# EAGLE design board_lt3086 (EAGLE 6.5.0)
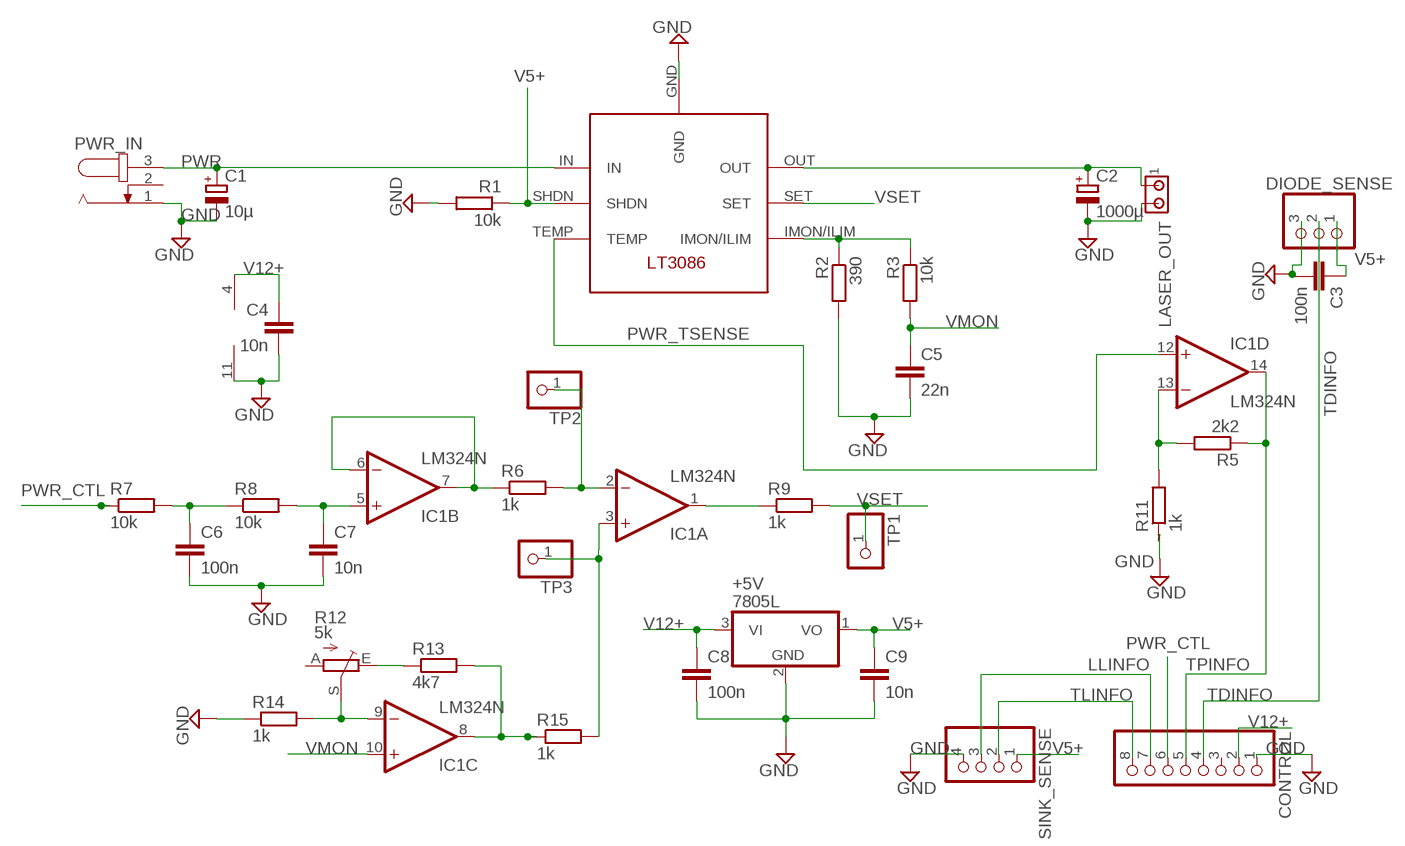
[diagram p0: schematic, sheet 1]

## Parts
+5V  7805L  [TO92]
C1  10µ  CPOL-EUE2.5-7  [E2,5-7]
C2  1000µ  CPOL-EUE3.5-10  [E3,5-10]
C3  100n  C-EU050-035X075  [C050-035X075]
C4  10n  C-EU050-024X044  [C050-024X044]
C5  22n  C-EU050-024X044  [C050-024X044]
C6  100n  C-EU050-035X075  [C050-035X075]
C7  10n  C-EU050-024X044  [C050-024X044]
C8  100n  C-EU050-035X075  [C050-035X075]
C9  10n  C-EU050-024X044  [C050-024X044]
CONTROL  PINHD-1X8  [1X08]
DIODE_SENSE  PINHD-1X3  [1X03]
IC1  LM324N  [DIL14]
LASER_OUT  350428-1  [350428-1]
PWR_CTRL  LT3086  [LT3086-T7]
PWR_IN  JACK-PLUG0  [SPC4077]
R1  10k  R-EU_0207/10  [0207/10]
R2  390  R-EU_0207/10  [0207/10]
R3  10k  R-EU_0207/10  [0207/10]
R5  2k2  R-EU_0207/10  [0207/10]
R6  1k  R-EU_0207/10  [0207/10]
R7  10k  R-EU_0207/10  [0207/10]
R8  10k  R-EU_0207/10  [0207/10]
R9  1k  R-EU_0207/10  [0207/10]
R11  1k  R-EU_0207/10  [0207/10]
R12  5k  TRIM_EU-CA9V  [CA9V]
R13  4k7  R-EU_0207/10  [0207/10]
R14  1k  R-EU_0207/10  [0207/10]
R15  1k  R-EU_0207/10  [0207/10]
SINK_SENSE  PINHD-1X4  [1X04]
TP1  PINHD-1X1  [1X01]
TP2  PINHD-1X1  [1X01]
TP3  PINHD-1X1  [1X01]

## Nets
GND: +5V.2(GND) C1.- C2.- C3.2 C4.2 C5.2 C6.2 C7.2 C8.2 C9.2 CONTROL.1 DIODE_SENSE.3 IC1.11(P:V-) LASER_OUT.2 PWR_CTRL.GND PWR_IN.1 R1.2 R2.2 R11.1 R14.1 SINK_SENSE.4
LLINFO: CONTROL.7 SINK_SENSE.3
N$1: IC1.6(B:-IN) IC1.7(B:OUT) R6.1
N$2: C7.1 IC1.5(B:+IN) R8.2
N$3: C6.1 R7.2 R8.1
N$4: IC1.1(A:OUT) R9.1
N$5: IC1.13(D:-IN) R5.2 R11.2
N$6: IC1.2(A:-IN) R6.2 TP2.1
N$7: IC1.3(A:+IN) R15.2 TP3.1
N$8: IC1.8(C:OUT) R13.2 R15.1
N$9: R12.E R13.1
N$10: IC1.9(C:-IN) R12.S R14.2
N$13: PWR_CTRL.IMON/ILIM R2.1 R3.1
PWR [pwr]: C1.+ PWR_CTRL.IN PWR_IN.3
PWR_CTL: CONTROL.6 R7.1
PWR_TSENSE: IC1.12(D:+IN) PWR_CTRL.TEMP
TDINFO: CONTROL.4 DIODE_SENSE.2
TLINFO: CONTROL.8 SINK_SENSE.2
TPINFO: CONTROL.5 IC1.14(D:OUT) R5.1
V5+: +5V.1(VO) C3.1 C9.1 DIODE_SENSE.1 PWR_CTRL.SHDN R1.1 SINK_SENSE.1
V12+: +5V.3(VI) C4.1 C8.1 CONTROL.2 IC1.4(P:V+)
VMON: C5.1 IC1.10(C:+IN) R3.2
VOUT [pwr]: C2.+ LASER_OUT.1 PWR_CTRL.OUT
VSET: PWR_CTRL.SET R9.2 TP1.1
Unconnected: CONTROL.3 PWR_IN.2 R12.A

## Library data of the parts
+5V = linear:78*: Positive VOLTAGE REGULATOR Source: http://cache.national.com/ds/LM/LM78L05.pdf http://www.fairchildsemi.com/ds/LM/LM7805.pdf
C1 C2 = rcl:CPOL-EU: POLARIZED CAPACITOR, European symbol
C3-C9 = rcl:C-EU: CAPACITOR, European symbol
CONTROL = pinhead:PINHD-1X8: PIN HEADER
DIODE_SENSE = pinhead:PINHD-1X3: PIN HEADER
IC1 = linear:LM324: OP AMP
LASER_OUT = con-amp:350428-1: Universal MATE-N-LOK .250" Centerline, 600 V, 19 - 36 A max Source: http://catalog.tycoelectronics.com/ .. ENG_CD_350428_Y.pdf
PWR_CTRL = custom:LT3086
PWR_IN = con-jack:JACK-PLUG: DC POWER JACK Power Jack, DC, Right Angle, Through Hole, Rated 5A at 16VDC, PC Terminals Distributor: Farnell (www.Farnell.de) Drawing: 84N1161.pdf / 84N1162.pdf Manufacturer: SPC Technology (www.spctechnology.com) Type: SPC4077 / SPC 4078; OC_FARNELL: unknown; OC_NEWARK: unknown
R1-R3 R5-R9 R11 R13-R15 = resistor:R-EU_: RESISTOR, European symbol
R12 = pot:TRIM_EU-: POTENTIOMETER
SINK_SENSE = pinhead:PINHD-1X4: PIN HEADER
TP1-TP3 = pinhead:PINHD-1X1: PIN HEADER

## Net classes
0 default: width 0.2 mm, clearance 0.205 mm
1 pwr: width 1.4 mm, clearance 0.205 mm

## Board
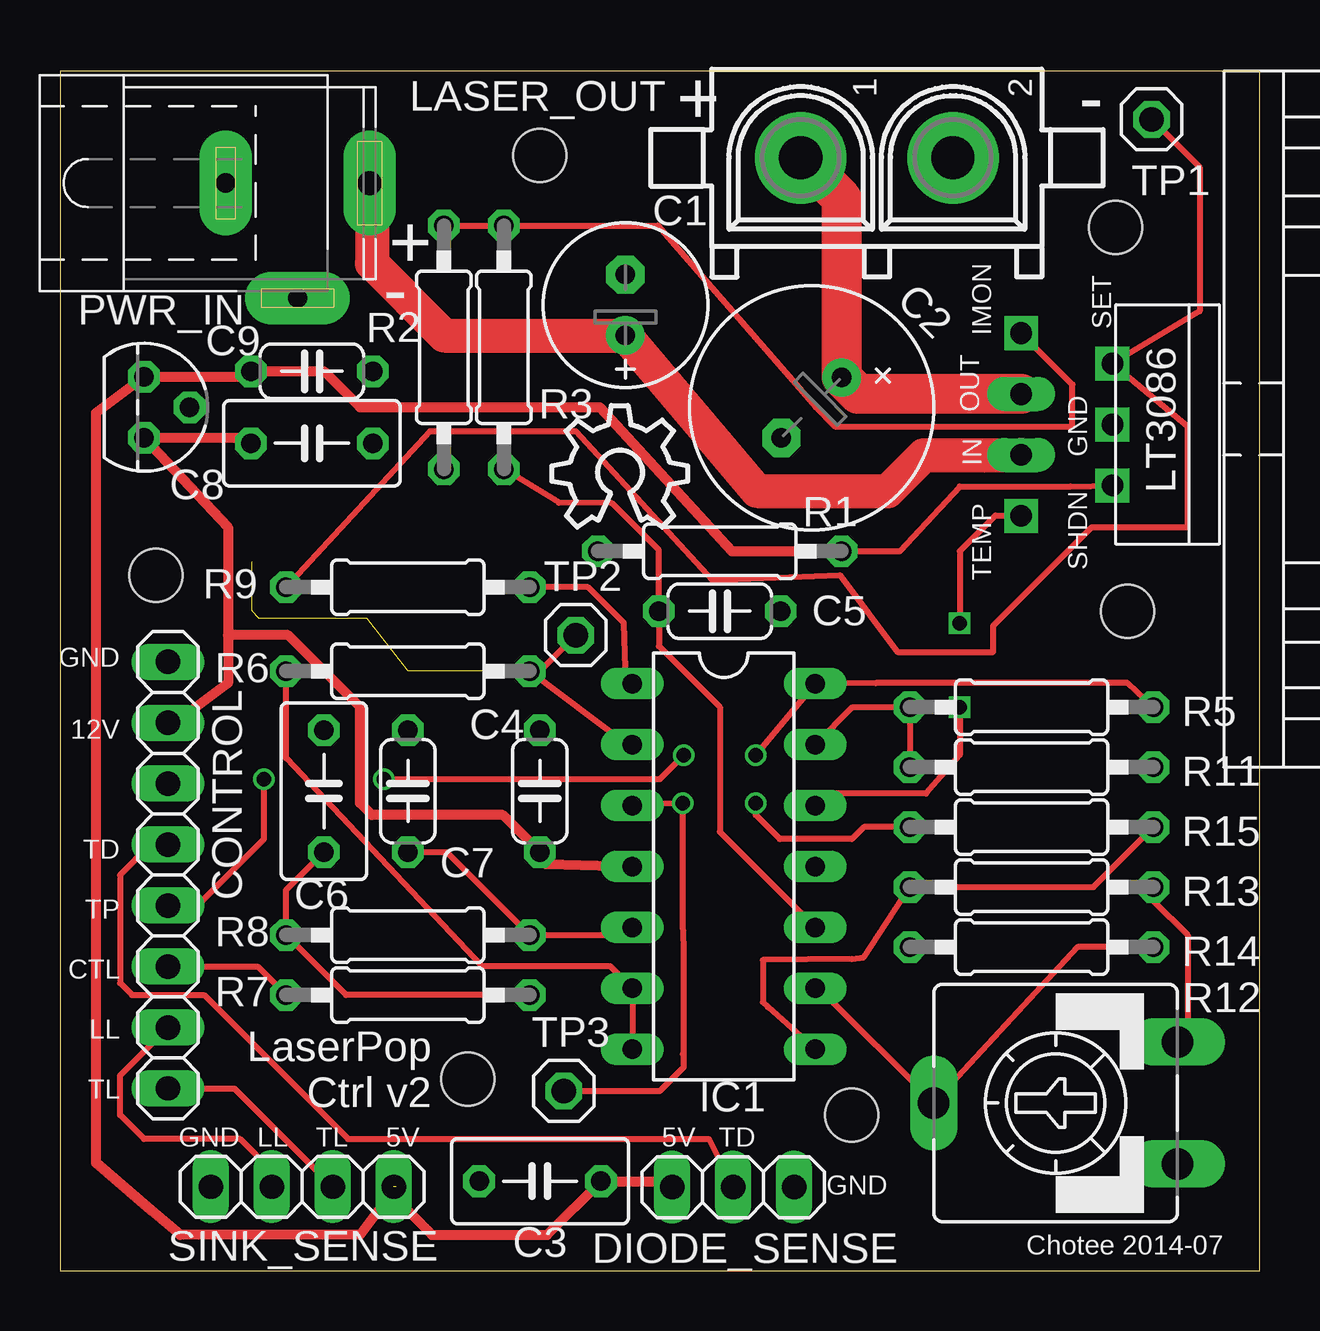
[diagram p1: board, top side]
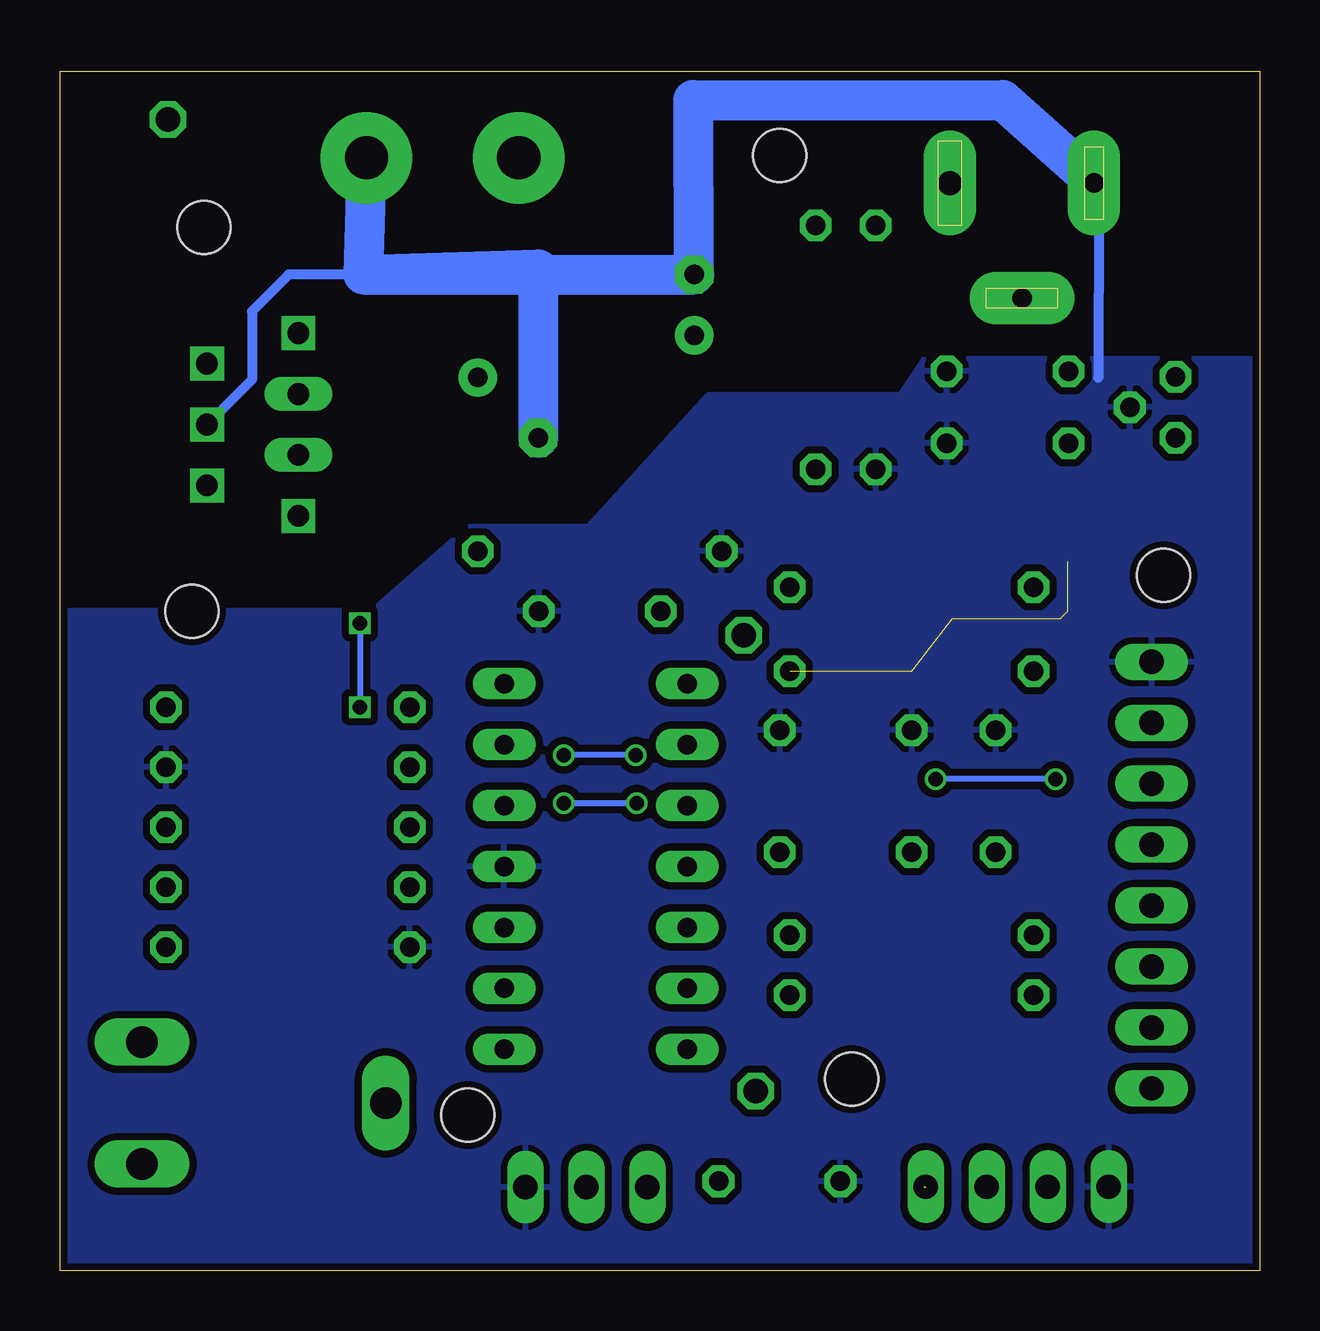
[diagram p2: board, bottom side, seen from below]

Size 50 x 50 mm. Coordinates in mm from the lower left corner, seen from the top.
Outline: 0,0 50,0 50,50 0,50 0,0
Copper layers (1*16): Top 0.035mm / dielectric 1.5mm / Bottom 0.035mm
Design rules "SeeedStudio_2layer_DRU_no_angle_20140221": minimum track width 6mil, minimum drill 12mil, track to track 6mil, track to pad 6mil, pad to pad 6mil, via to via 6mil, smd to smd 0mil, copper to edge 10mil, drill to drill 10mil, minimum pad ring 10mil, minimum via ring 6mil, stop-mask expansion 2mil, vias tented up to drill 100mil, thermal gap 10mil
Holes 2.2 mm at 4,29 20,46.5 33,6.5 44.5,27.5 17,8 44,43.5

### Footprints (pad centres in the part's own frame; a part is rotated, then mirrored left to right if it is on the bottom)
TO92 = drill 0.813 octagon: 1 -1.27,0; 2 0,1.905; 3 1.27,0
E2,5-7 = drill 0.813 pad 1.6: + -1.27,0 | drill 0.813 pad 1.6 octagon: - 1.27,0
E3,5-10 = drill 0.813 pad 1.6: + -1.778,0 | drill 0.813 pad 1.6 octagon: - 1.778,0
C050-035X075 = drill 0.813 octagon: 1 -2.54,0; 2 2.54,0
C050-024X044 = drill 0.813 octagon: 1 -2.54,0; 2 2.54,0
1X08 = drill 1.016 long: 1 -8.89,0; 2 -6.35,0; 3 -3.81,0; 4 -1.27,0; 5 1.27,0; 6 3.81,0; 7 6.35,0; 8 8.89,0
1X03 = drill 1.016 long: 1 -2.54,0; 2 0,0; 3 2.54,0
DIL14 = drill 0.813 long: 1 -7.62,-3.81; 2 -5.08,-3.81; 3 -2.54,-3.81; 4 0,-3.81; 5 2.54,-3.81; 6 5.08,-3.81; 7 7.62,-3.81; 8 7.62,3.81; 9 5.08,3.81; 10 2.54,3.81; 11 0,3.81; 12 -2.54,3.81; 13 -5.08,3.81; 14 -7.62,3.81
350428-1 = drill 1.8 pad 3.81: 1 -3.175,0; 2 3.175,0
LT3086-T7 = drill 0.9 square: GND 0,0; IMON/ILIM -3.81,-3.81; SET -2.54,0; SHDN 2.54,0; TEMP 3.81,-3.81 | drill 0.9 long: IN 1.27,-3.81; OUT -1.27,-3.81
SPC4077 = drill 0.8 pad 2.184 long: 1 -3,0; 2 0,-4.8 | drill 1 pad 2.184 long: 3 3,0
0207/10 = drill 0.813 octagon: 1 -5.08,0; 2 5.08,0
CA9V = drill 1.321 long: A -2.54,-5.08; E 2.54,-5.08; S 0,5.08
1X04 = drill 1.016 long: 1 -3.81,0; 2 -1.27,0; 3 1.27,0; 4 3.81,0
1X01 = drill 1.016 octagon: 1 0,0

### Placement (x,y rotation side)
+5V  3.5,36 270 top
C1  23.57,40.26 90 top
C2  31.33,35.98 225 top
C3  20.01,3.74 180 top
C4  20,20 90 top
C5  27.5,27.5 0 top
C6  11,20 90 top
C7  14.5,20 90 top
C8  10.5,34.5 0 top
C9  10.5,37.5 0 top
CONTROL  4.5,16.5 270 top
DIODE_SENSE  28.06,3.49 0 top
IC1  27.67,16.86 270 top
LASER_OUT  34.05,46.4 0 top
PWR_CTRL  43.87,35.28 270 top
PWR_IN  9.9,45.35 0 top
R1  27.5,30 180 top
R2  16,38.5 270 top
R3  18.5,38.5 270 top
R5  40.5,23.5 180 top
R6  14.5,25 0 top
R7  14.5,11.5 0 top
R8  14.5,14 0 top
R9  14.5,28.5 180 top
R11  40.5,21 180 top
R12  41.5,7 90 top
R13  40.5,16 180 top
R14  40.5,13.5 0 top
R15  40.5,18.5 180 top
SINK_SENSE  10.1,3.51 180 top
TP1  45.5,48 0 top
TP2  21.5,26.5 0 top
TP3  21,7.5 0 top
U$1  [OSHW_8X200_NOTEXT]  20.5,31 0 top
U$2  [HEATSINK-11C/W]  48.5,35.5 270 top

### Tracks (layer width: path | path; a pad name or v marks a point on that pad's centre or on a via)
GND
  Bottom 0.406: 37.35,41.53 40.47,41.53 42,40 42,37.15 PWR_CTRL.GND | 7.02,45.53 6.5,45.53 6.7,44.32 6.72,37.22
  Bottom 1.676: LASER_OUT.2 37.35,41.53 | 37.35,41.53 C1.- 23.6,48.8 10.7,48.8 7.03,45.53 7.02,45.53 PWR_IN.1 | 37.35,41.53 30.07,41.75 C2.-
  pour Bottom (isolate 0.305): 0,38 14,38 15,36.5 23,36.5 28,31 33,31 37,27.5 50,27.5 50,0 0,0
LLINFO
  Top 0.254: SINK_SENSE.3 8.83,4.17 7.5,5.5 3.5,5.5 2.5,6.5 2.5,8.15 CONTROL.7
N$1
  Top 0.254: IC1.7 IC1.6 22.94,12.7 17.6,12.7 9.42,21.38 R6.1
N$2
  Top 0.254: C7.1 16.12,17.46 R8.2 23.54,14 IC1.5
N$3
  Top 0.254: R7.2 11.92,11.5 R8.1 9.42,15.88 C6.1
N$4
  Top 0.254: IC1.1 23.6,24.48 23.5,27 22,28.5 R9.1
N$5
  Top 0.254: IC1.13 33.04,23.5 R5.2 R11.2
N$6  (5 unrouted)
  Top 0.254: IC1.2 23.64,21.94 R6.2 20,25 TP2.1
N$7  (via drill 0.6)
  Top 0.254: IC1.3 v25.96,19.5 25.96,14.46 26,13.5 26,9 | TP3.1 25,7.5 26,8.5 26,9 | 25.96,9.04 26,9 | R15.2 33.5,18.5 33,18 30,18 29,19 v29,19.5
  Bottom 0.254: v29,19.5 v25.96,19.5
N$8
  Top 0.254: IC1.8 29.5,11 29.3,11.2 29.3,12.96 33,13 33.5,13.08 R13.2 43.08,16 R15.1
N$9
  Top 0.254: R13.1 45.58,15.42 47,14 47,10.46 R12.E
N$10
  Top 0.254: R14.2 42.42,13.5 R12.S 31.64,11.78 IC1.9
N$13
  Top 0.254: R2.1 R3.1 24.92,43.58 31.5,36 32.3,35.2 42.2,35.2 42.2,36.95 PWR_CTRL.IMON/ILIM
PWR
  Top 1.422: 38.54,33.99 PWR_CTRL.IN 36,34 34.5,32.5 29.05,32.51 C1.+ 16.01,38.99 13,42 13,45.25 PWR_IN.3
PWR_CTL
  Top 0.254: CONTROL.6 8.23,12.69 R7.1
PWR_TSENSE  (via drill 0.6)
  Top 0.254: PWR_CTRL.TEMP 39.03,31.47 39,31.5 37.5,30 v37.5,27 | v37.5,23.5 37.5,21.5 36.1,19.9 31.9,19.9 IC1.12
  Bottom 0.254: v37.5,27 v37.5,23.5
TDINFO
  Top 0.254: CONTROL.4 3.77,17.77 2.5,16.5 2.5,12 3,11.5 6,11.5 12,5.5 27.05,5.5 DIODE_SENSE.2
TLINFO
  Top 0.254: CONTROL.8 7.27,7.61 SINK_SENSE.2
TPINFO  (via drill 0.6)
  Top 0.254: R5.1 44.5,24.5 34,24.5 IC1.14 v29,21.5 | v13.5,20.5 25,20.5 v26,21.5 | v8.5,20.5 8.5,18 5.73,15.23 CONTROL.5
  Bottom 0.254: v8.5,20.5 v13.5,20.5 | v26,21.5 v29,21.5
V5+  (1 unrouted)
  Top 0.2: 13.97,2.54 SINK_SENSE.1 | 3.81,2.54 3.8,2.53
  Top 0.254: R1.1 35,30 37.5,32.7 42.13,32.7 PWR_CTRL.SHDN
  Top 0.406: R1.1 28,30 22.5,36 12.5,36 11,37.5 C9.1 7.73,37.27 +5V.1 1.5,35.77 1.5,4.5 3.8,2.53 5,1.5 12.5,1.5 14,3.5 14,3 15.5,1.5 20.31,1.5 C3.1 25.27,3.74 DIODE_SENSE.1
V12+
  Top 0.406: 7,26.5 7,31 +5V.3 7.73,34.73 C8.1 | 7,26.5 7,24.5 5,23 4.35,23 CONTROL.2 | IC1.4 20.26,16.96 C4.1 18.46,19 13,19 12.5,19.5 12.5,23.5 9.5,26.5 7,26.5
VMON
  Top 0.254: R3.2 20.8,32.02 23,32 24.96,30.04 C5.1 24.96,26.04 27.5,23.5 27.5,18.3 IC1.10
VOUT
  Top 1.422: 30.83,46.35 LASER_OUT.1
  Top 1.676: PWR_CTRL.OUT 33.27,36.55 C2.+ 32.59,44.69 LASER_OUT.1
VSET
  Top 0.254: R9.2 15.42,35 21.5,35 27.2,28.8 32.5,29 34.9,25.8 38.9,25.8 38.9,26.9 43,31 47,31 47,35.19 PWR_CTRL.SET 47.5,40 47.5,46 TP1.1

### Text on the board
tNames: + | - | + | - | IMON | SET | OUT | GND | IN | TEMP | SHDN | GND | 12V | TD | TP | CTL | LL | LaserPop / Ctrl v2 | TL | GND | LL | TL | 5V | 5V | TD | GND | Chotee 2014-07